# EAGLE schematic one-wire (EAGLE 7.6.0)
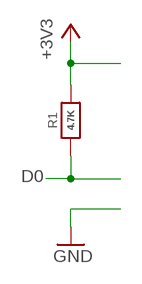
[diagram p0: schematic, sheet 1]

## Parts
R1  4.7K  RESISTOR_0603_NOOUT  [0603-NO]

## Nets
+3V3: R1.2
D0: R1.1

## Library data of the parts
R1 = microbuilder:RESISTOR: Resistors For new designs, use the packages preceded by an '_' character since they are more reliable: The following footprints should be used on most boards: _0402 - Standard footprint for regular board layouts _0603 - Standard footprint for regular board layouts _0805 - Standard footprint for regular board layouts _1206 - Standard footprint for regular board layouts For extremely tight-pitch boards where space is at a premium, the following 'micro-pitch' footprints can be used (smaller pads, no silkscreen outline, etc.): _0402MP - Micro-pitch footprint for very dense/compact boards _0603MP - Micro-pitch footprint for very dense/compact boards _0805MP - Micro-pitch footprint for very dense/compact boards _1206MP - Micro-pitch footprint for very dense/compact boards

## Net classes
1 power: width 0.305 mm